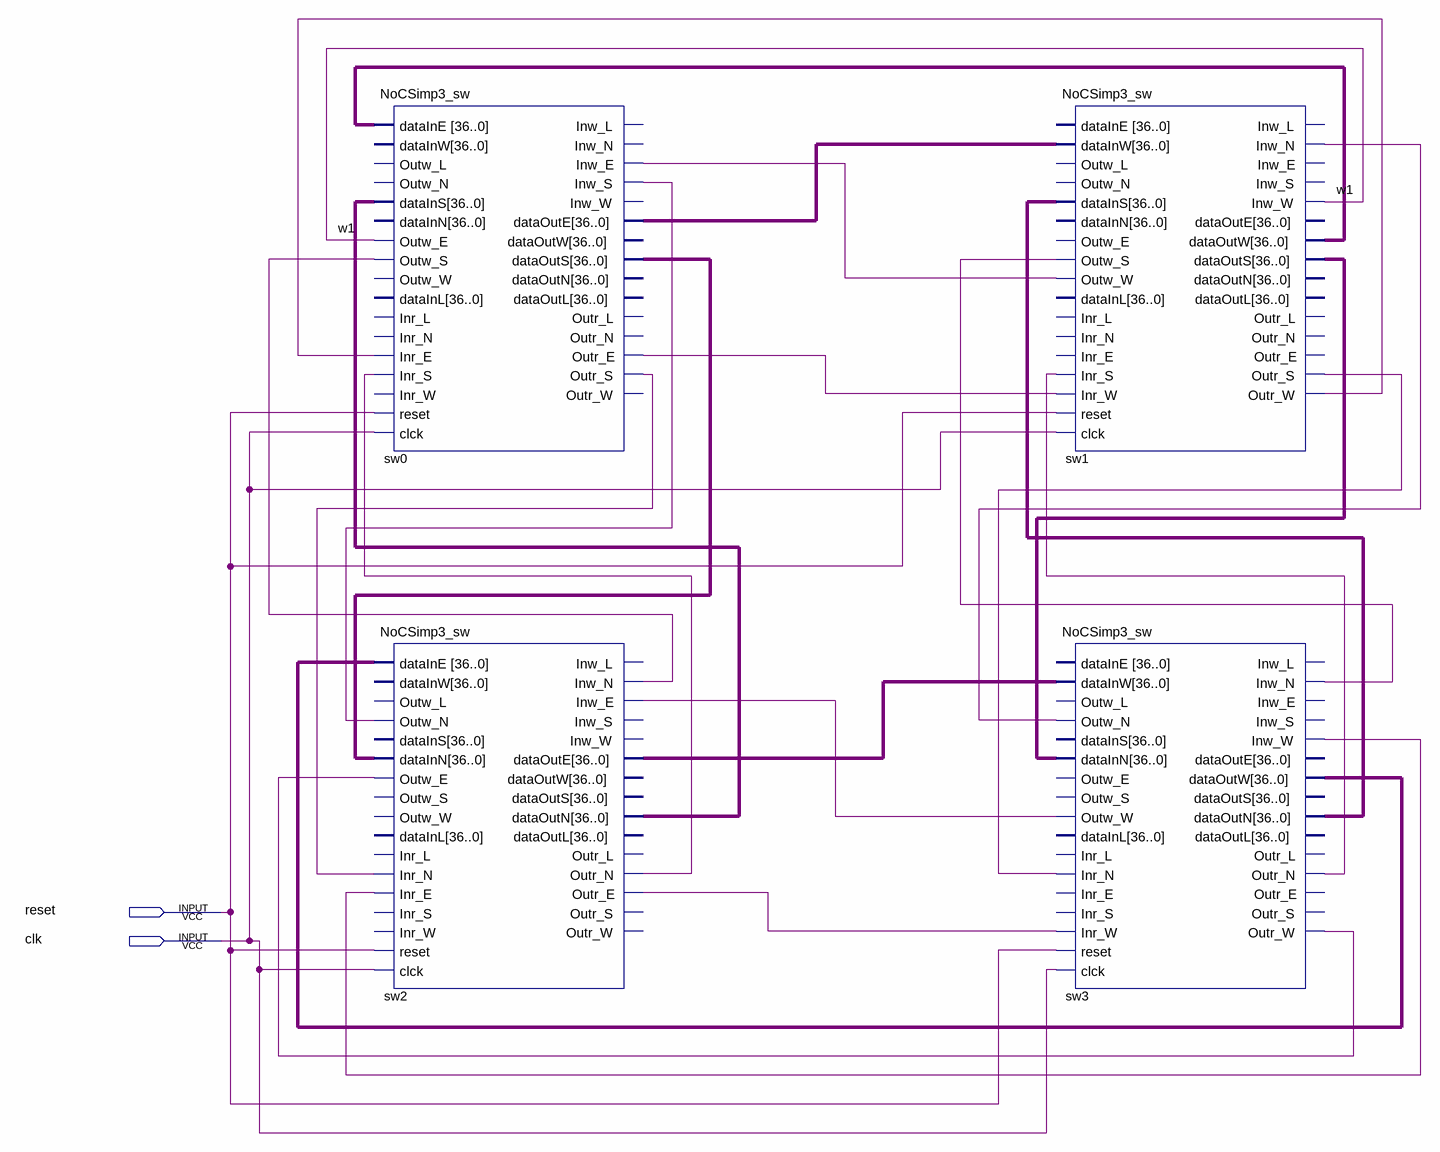
[diagram p0: schematic sheet]
// Quartus schematic 4sw.bdf as structural Verilog: 4 symbols, 2 pins
module \4sw  (
  input  reset,
  input  clk
);

  wire sw0_inw_e, sw0_inw_s, sw0_outr_e, sw0_outr_s, sw1_inw_n, sw1_outr_s, sw1_outr_w, sw2_inw_e, sw2_inw_n,
       sw2_outr_e, sw2_outr_n, sw3_inw_n, sw3_inw_w, sw3_outr_n, sw3_outr_w, w1;
  wire [36:0] sw0_dataoute, sw0_dataouts, sw1_dataouts, sw1_dataoutw, sw2_dataoute, sw2_dataoutn,
       sw3_dataoutn, sw3_dataoutw;

  NoCSimp3_sw sw0 (
    .dataInE(sw1_dataoutw), .dataInS(sw2_dataoutn), .Outw_E(w1), .Outw_S(sw2_inw_n), .Inr_E(sw1_outr_w),
    .Inr_S(sw2_outr_n), .reset(reset), .clck(clk), .Inw_E(sw0_inw_e), .Inw_S(sw0_inw_s),
    .dataOutE(sw0_dataoute), .dataOutS(sw0_dataouts), .Outr_E(sw0_outr_e), .Outr_S(sw0_outr_s));  // open: dataInW, Outw_L, Outw_N, dataInN, Outw_W, dataInL, Inr_L, Inr_N, Inr_W, Inw_L, Inw_N, Inw_W, dataOutW, dataOutN, dataOutL, Outr_L, Outr_N, Outr_W
  NoCSimp3_sw sw2 (
    .dataInE(sw3_dataoutw), .Outw_N(sw0_inw_s), .dataInN(sw0_dataouts), .Outw_E(sw3_outr_w),
    .Inr_N(sw0_outr_s), .Inr_E(sw3_inw_w), .reset(reset), .clck(clk), .Inw_N(sw2_inw_n), .Inw_E(sw2_inw_e),
    .dataOutE(sw2_dataoute), .dataOutN(sw2_dataoutn), .Outr_N(sw2_outr_n), .Outr_E(sw2_outr_e));  // open: dataInW, Outw_L, dataInS, Outw_S, Outw_W, dataInL, Inr_L, Inr_S, Inr_W, Inw_L, Inw_S, Inw_W, dataOutW, dataOutS, dataOutL, Outr_L, Outr_S, Outr_W
  NoCSimp3_sw sw1 (
    .dataInW(sw0_dataoute), .dataInS(sw3_dataoutn), .Outw_S(sw3_inw_n), .Outw_W(sw0_inw_e),
    .Inr_S(sw3_outr_n), .Inr_W(sw0_outr_e), .reset(reset), .clck(clk), .Inw_N(sw1_inw_n), .Inw_W(w1),
    .dataOutW(sw1_dataoutw), .dataOutS(sw1_dataouts), .Outr_S(sw1_outr_s), .Outr_W(sw1_outr_w));  // open: dataInE, Outw_L, Outw_N, dataInN, Outw_E, dataInL, Inr_L, Inr_N, Inr_E, Inw_L, Inw_E, Inw_S, dataOutE, dataOutN, dataOutL, Outr_L, Outr_N, Outr_E
  NoCSimp3_sw sw3 (
    .dataInW(sw2_dataoute), .Outw_N(sw1_inw_n), .dataInN(sw1_dataouts), .Outw_W(sw2_inw_e),
    .Inr_N(sw1_outr_s), .Inr_W(sw2_outr_e), .reset(reset), .clck(clk), .Inw_N(sw3_inw_n), .Inw_W(sw3_inw_w),
    .dataOutW(sw3_dataoutw), .dataOutN(sw3_dataoutn), .Outr_N(sw3_outr_n), .Outr_W(sw3_outr_w));  // open: dataInE, Outw_L, dataInS, Outw_E, Outw_S, dataInL, Inr_L, Inr_E, Inr_S, Inw_L, Inw_E, Inw_S, dataOutE, dataOutS, dataOutL, Outr_L, Outr_E, Outr_S
endmodule
